# EasyEDA schematic SCH_GPS-rx_2026-03-24.json
TITLE: GPS-RX; REV: 1.0; Date: 2026-03-11; Sheet: 1/1; Company: KarthikeyaVarma Chekuri
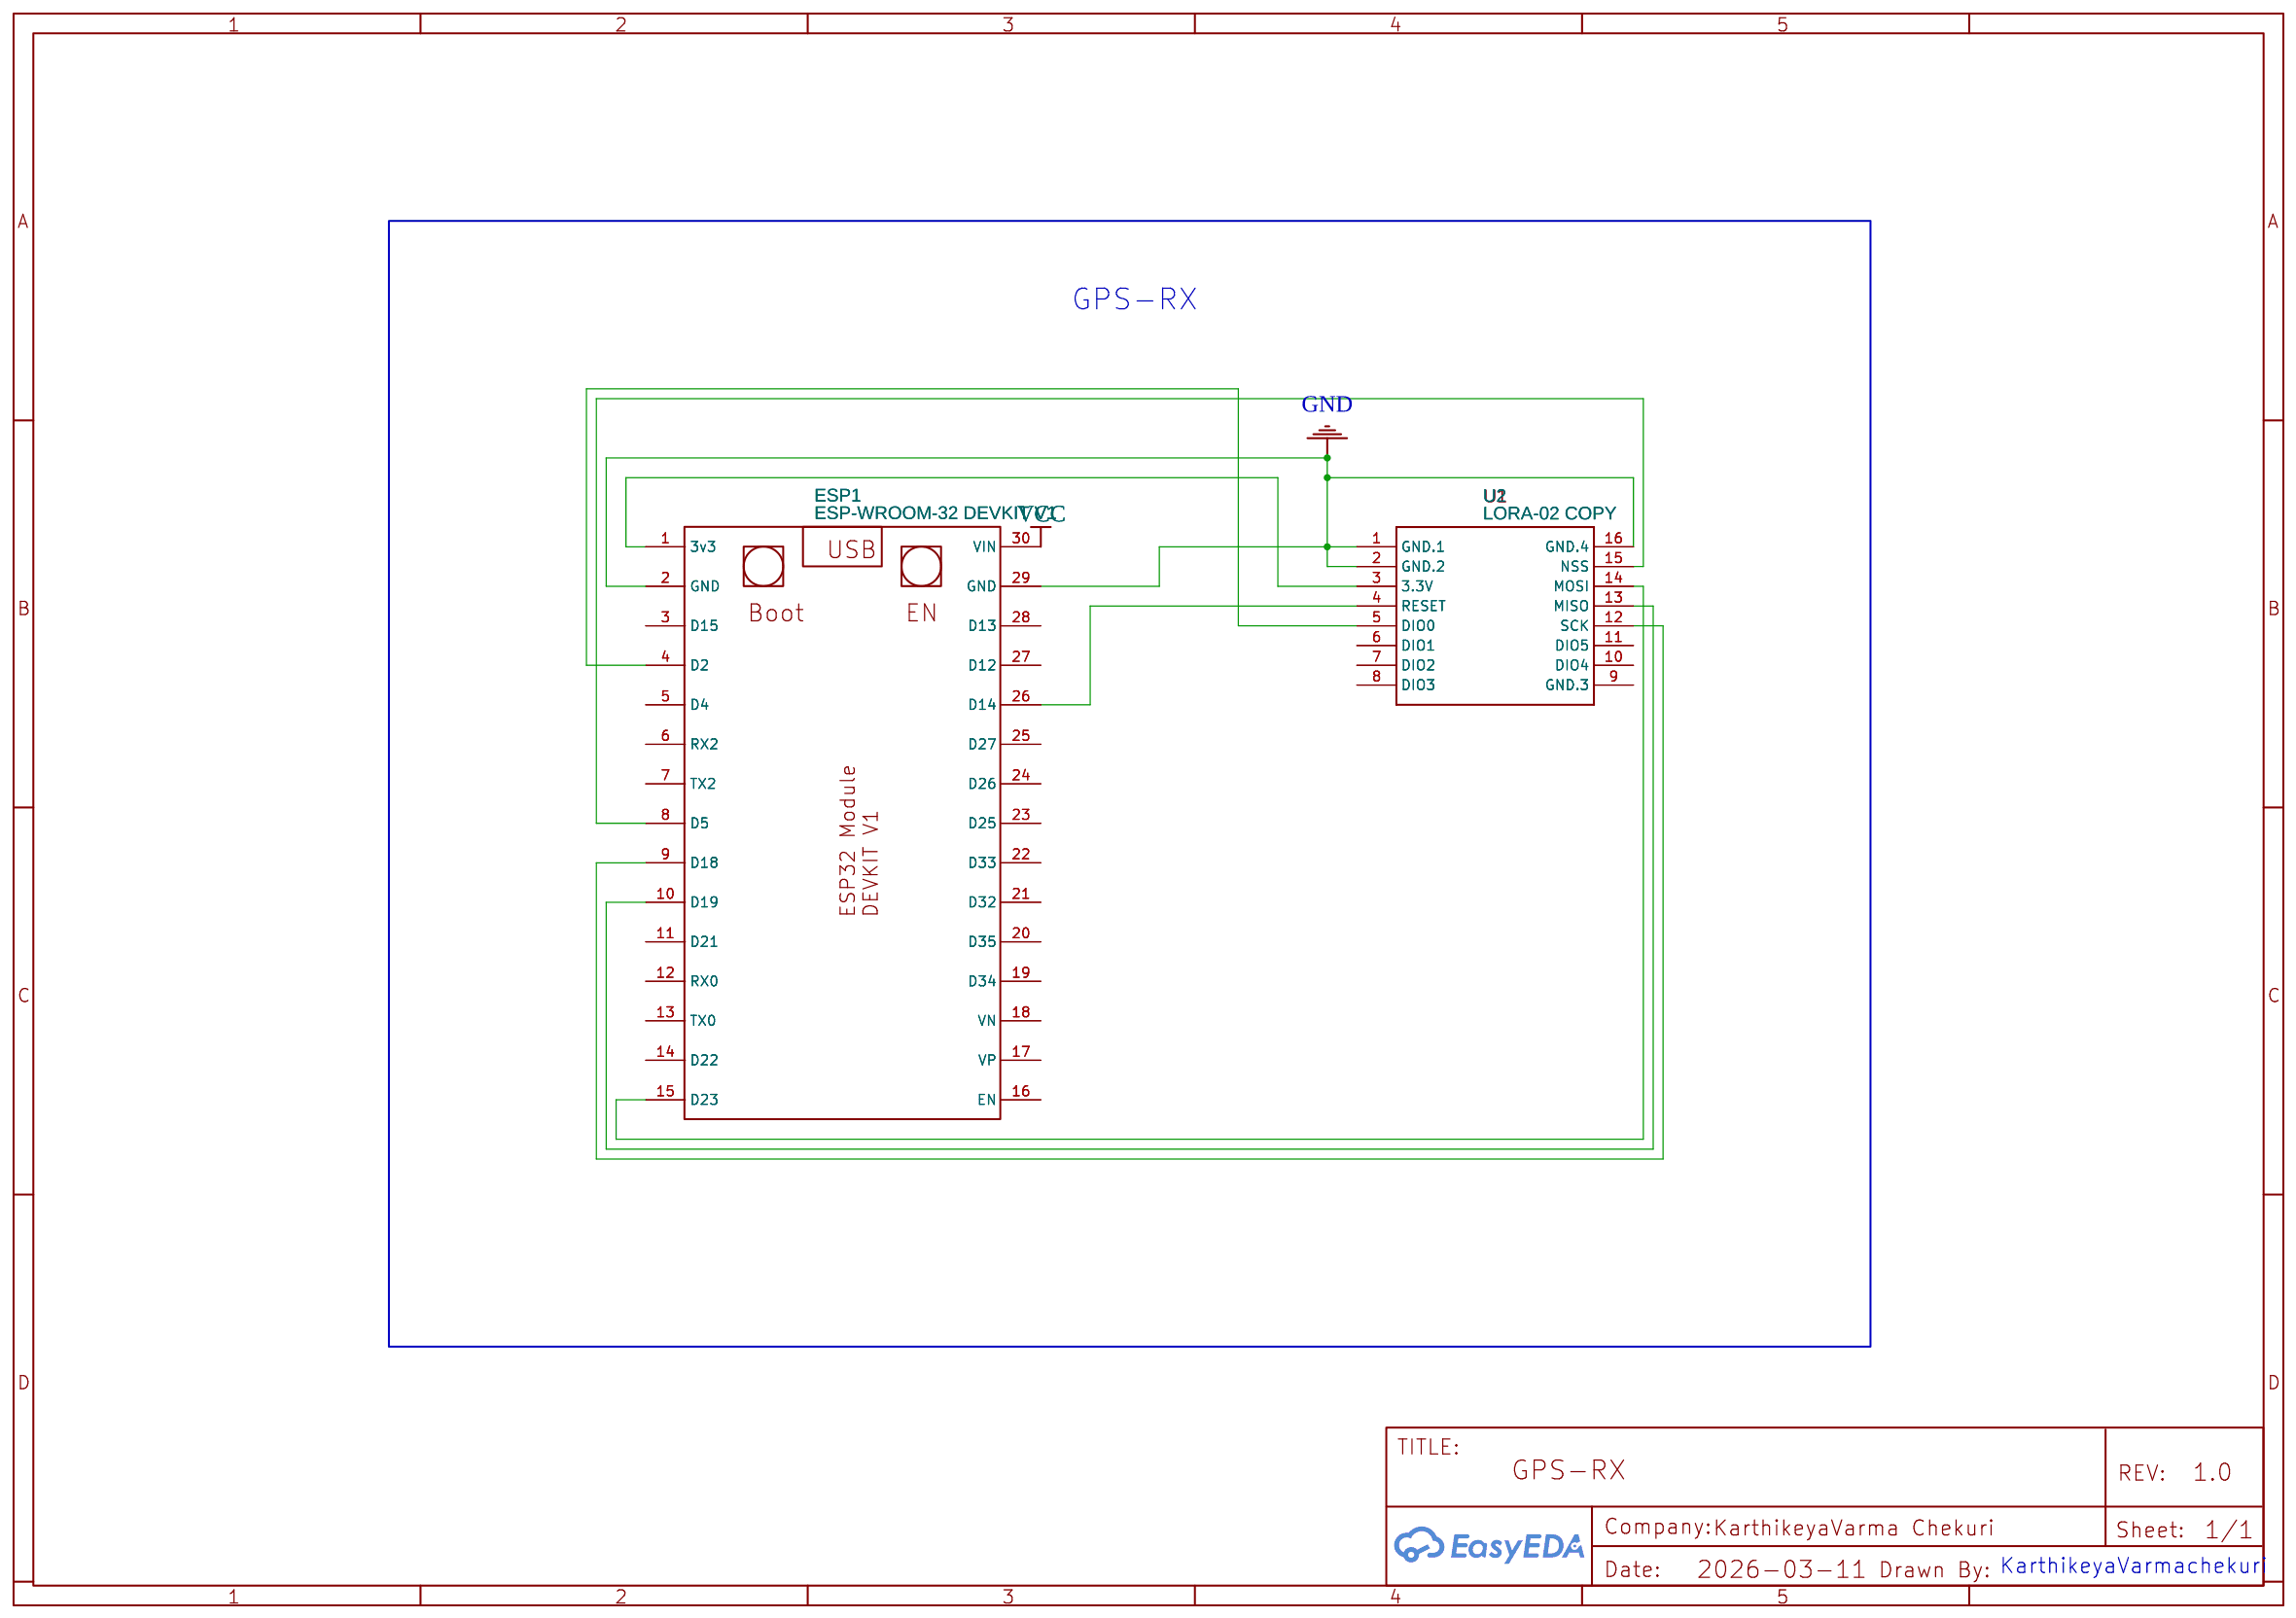
[diagram p0: schematic sheet]

## Parts
ESP1  ESP-WROOM-32 DEVKIT V1  [ESP-WROOM-32 DEVKIT V1]
U2  LORA-02 COPY  [LORA-02]

## Library data of the parts
ESP1 = ESP-WROOM-32 DEVKIT V1: Contributor: Zenmka; link: http://infoaleze.chez.com
U2 = LORA-02 COPY: link: https://www.elecrow.com/sx1278-lora-module-433m-10km-ra-02-wireless-spread-spectrum-transmission-socket-for-smart-home-diy.html; Contributor: Morningstar

## Nets
GND: ESP1.2(GND) ESP1.29(GND) U2.1(GND.1) U2.2(GND.2) U2.16(GND.4)
VCC: ESP1.30(VIN)
Net-(ESP1-1): ESP1.1(3v3) U2.3(3.3V)
Net-(ESP1-4): ESP1.4(D2) U2.5(DIO0)
Net-(ESP1-8): ESP1.8(D5) U2.15(NSS)
Net-(ESP1-9): ESP1.9(D18) U2.12(SCK)
Net-(ESP1-10): ESP1.10(D19) U2.13(MISO)
Net-(ESP1-15): ESP1.15(D23) U2.14(MOSI)
Net-(ESP1-26): ESP1.26(D14) U2.4(RESET)

Not connected (* = marked no-connect by the designer): ESP1 3(D15) 5(D4) 6(RX2) 7(TX2) 11(D21) 12(RX0) 13(TX0) 14(D22) 16(EN) 17(VP) 18(VN) 19(D34) 20(D35) 21(D32) 22(D33) 23(D25) 24(D26) 25(D27) 27(D12) 28(D13); U2 6(DIO1) 7(DIO2) 8(DIO3) 9(GND.3) 10(DIO4) 11(DIO5)

## Notes on the sheet
- GPS-RX
- KarthikeyaVarmachekuri
